# Altium schematic sheet connectors.SchDoc: Gimbal Board Connectors
size A4; DrawnBy: Edward H and Maggie Z
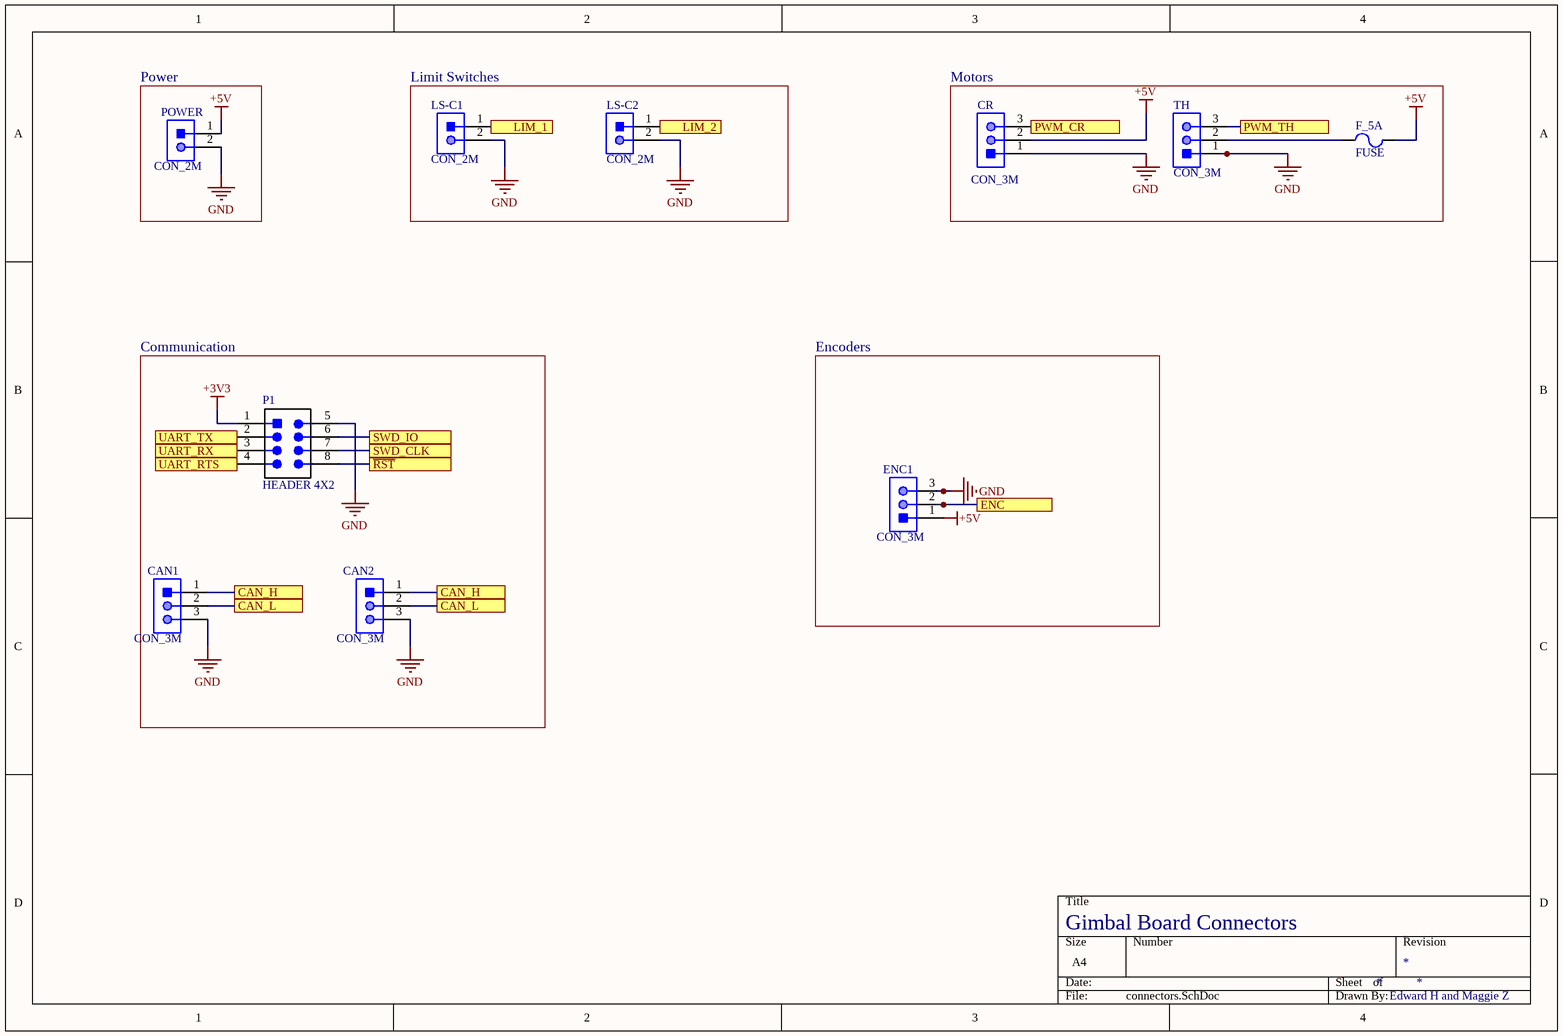
[diagram p0: connectors.SchDoc]

## Parts
CAN1  CON_3M  [JST-B3B-SM4-TB]
CAN2  CON_3M  [JST-B3B-SM4-TB]
CR  CON_3M  [JST-B3B-SM4-TB]
ENC1  CON_3M  [JST-B3B-SM4-TB]
F_5A  FUSE  [FUSE]
LS-C1  CON_2M  [JST-B2B-PHSK]
LS-C2  CON_2M  [JST-B2B-PHSK]
P1  HEADER 4X2  [HEADER_2X4]
POWER  CON_2M  [JST-B2B-PHSK]
TH  CON_3M  [JST B03B-PASK]

## Blocks framed on the sheet
Power: POWER
Limit Switches: LS-C1 LS-C2
Motors: CR F_5A TH
Communication: CAN1 CAN2 P1
Encoders: ENC1

## Ports
CAN_H, CAN_L, ENC, LIM_1, LIM_2, PWM_CR, PWM_TH, SWD_CLK, SWD_IO, UART_RTS, UART_RX, UART_TX, ~{RST}

## Nets
+3V3: P1.1(VCC)
+5V: CR.2 ENC1.1 F_5A.2 POWER.1
GND: CAN1.3 CAN2.3 CR.1 ENC1.3 LS-C1.2 LS-C2.2 P1.5(GND) POWER.2 TH.1
~{RST}: P1.8 ; port ~{RST}
CAN_H: CAN1.1 CAN2.1 ; port CAN_H
CAN_L: CAN1.2 CAN2.2 ; port CAN_L
ENC: ENC1.2 ; port ENC
LIM_1: LS-C1.1 ; port LIM_1
LIM_2: LS-C2.1 ; port LIM_2
PWM_CR: CR.3 ; port PWM_CR
PWM_TH: TH.3 ; port PWM_TH
SWD_CLK: P1.7 ; port SWD_CLK
SWD_IO: P1.6 ; port SWD_IO
UART_RTS: P1.4 ; port UART_RTS
UART_RX: P1.3 ; port UART_RX
UART_TX: P1.2 ; port UART_TX
NetF_5A_1: F_5A.1 TH.2

## Library data of the parts
F_5A = FUSE-5A: FUSE HOLDER RADIAL 250V 6.3A PCB
P1 = HEADER 4X2: Header, 4-Pin Dual row; MPN: GRPB042VWVN-RC; Manufacturer: Sullins Connector Solutions; Digikey Part Number: S9015E-04-ND